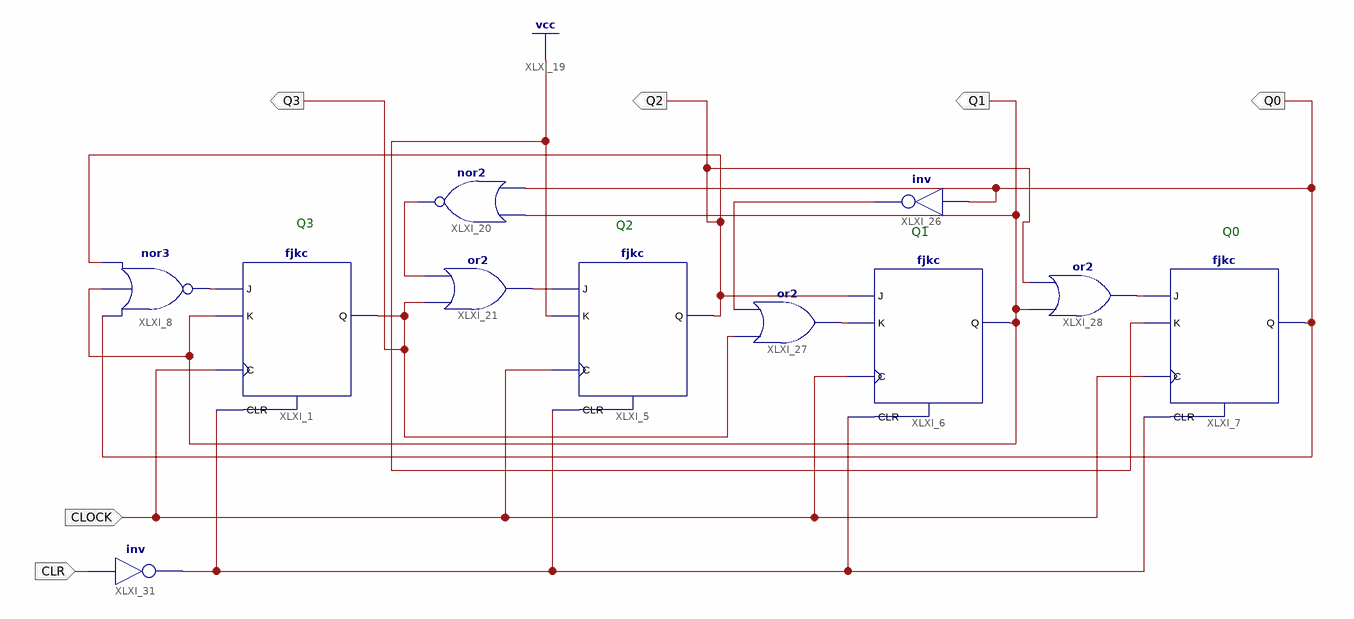
[diagram p0: schematic sheet 1]
// Xilinx ISE schematic zad1_schematic.sch (xc9500xl) as structural Verilog: 11 symbols, 6 ports
module zad1_schematic (
  input  CLOCK,
  input  CLR,
  output Q2,
  output Q1,
  output Q0,
  output Q3
);

  wire XLXN_5, XLXN_15, XLXN_17, XLXN_28, XLXN_29, XLXN_31, XLXN_46;

  fjkc XLXI_6 (.C(CLOCK), .CLR(XLXN_46), .J(Q2), .K(XLXN_28), .Q(Q1));
  fjkc XLXI_1 (.C(CLOCK), .CLR(XLXN_46), .J(XLXN_5), .K(Q1), .Q(Q3));
  fjkc XLXI_5 (.C(CLOCK), .CLR(XLXN_46), .J(XLXN_15), .K(1'b1), .Q(Q2));
  nor XLXI_8 (XLXN_5, Q0, Q1, Q2);
  or XLXI_21 (XLXN_15, Q3, XLXN_17);
  nor XLXI_20 (XLXN_17, Q0, Q1);
  fjkc XLXI_7 (.C(CLOCK), .CLR(XLXN_46), .J(XLXN_31), .K(1'b1), .Q(Q0));
  not XLXI_26 (XLXN_29, Q0);
  or XLXI_27 (XLXN_28, Q3, XLXN_29);
  or XLXI_28 (XLXN_31, Q1, Q2);
  not XLXI_31 (XLXN_46, CLR);

  // Notes on the sheet:
  //   Q3
  //   Q2
  //   Q1
  //   Q0
endmodule
